# EAGLE design Lumiboard - sensor module (rev C) (EAGLE 6.5.0)
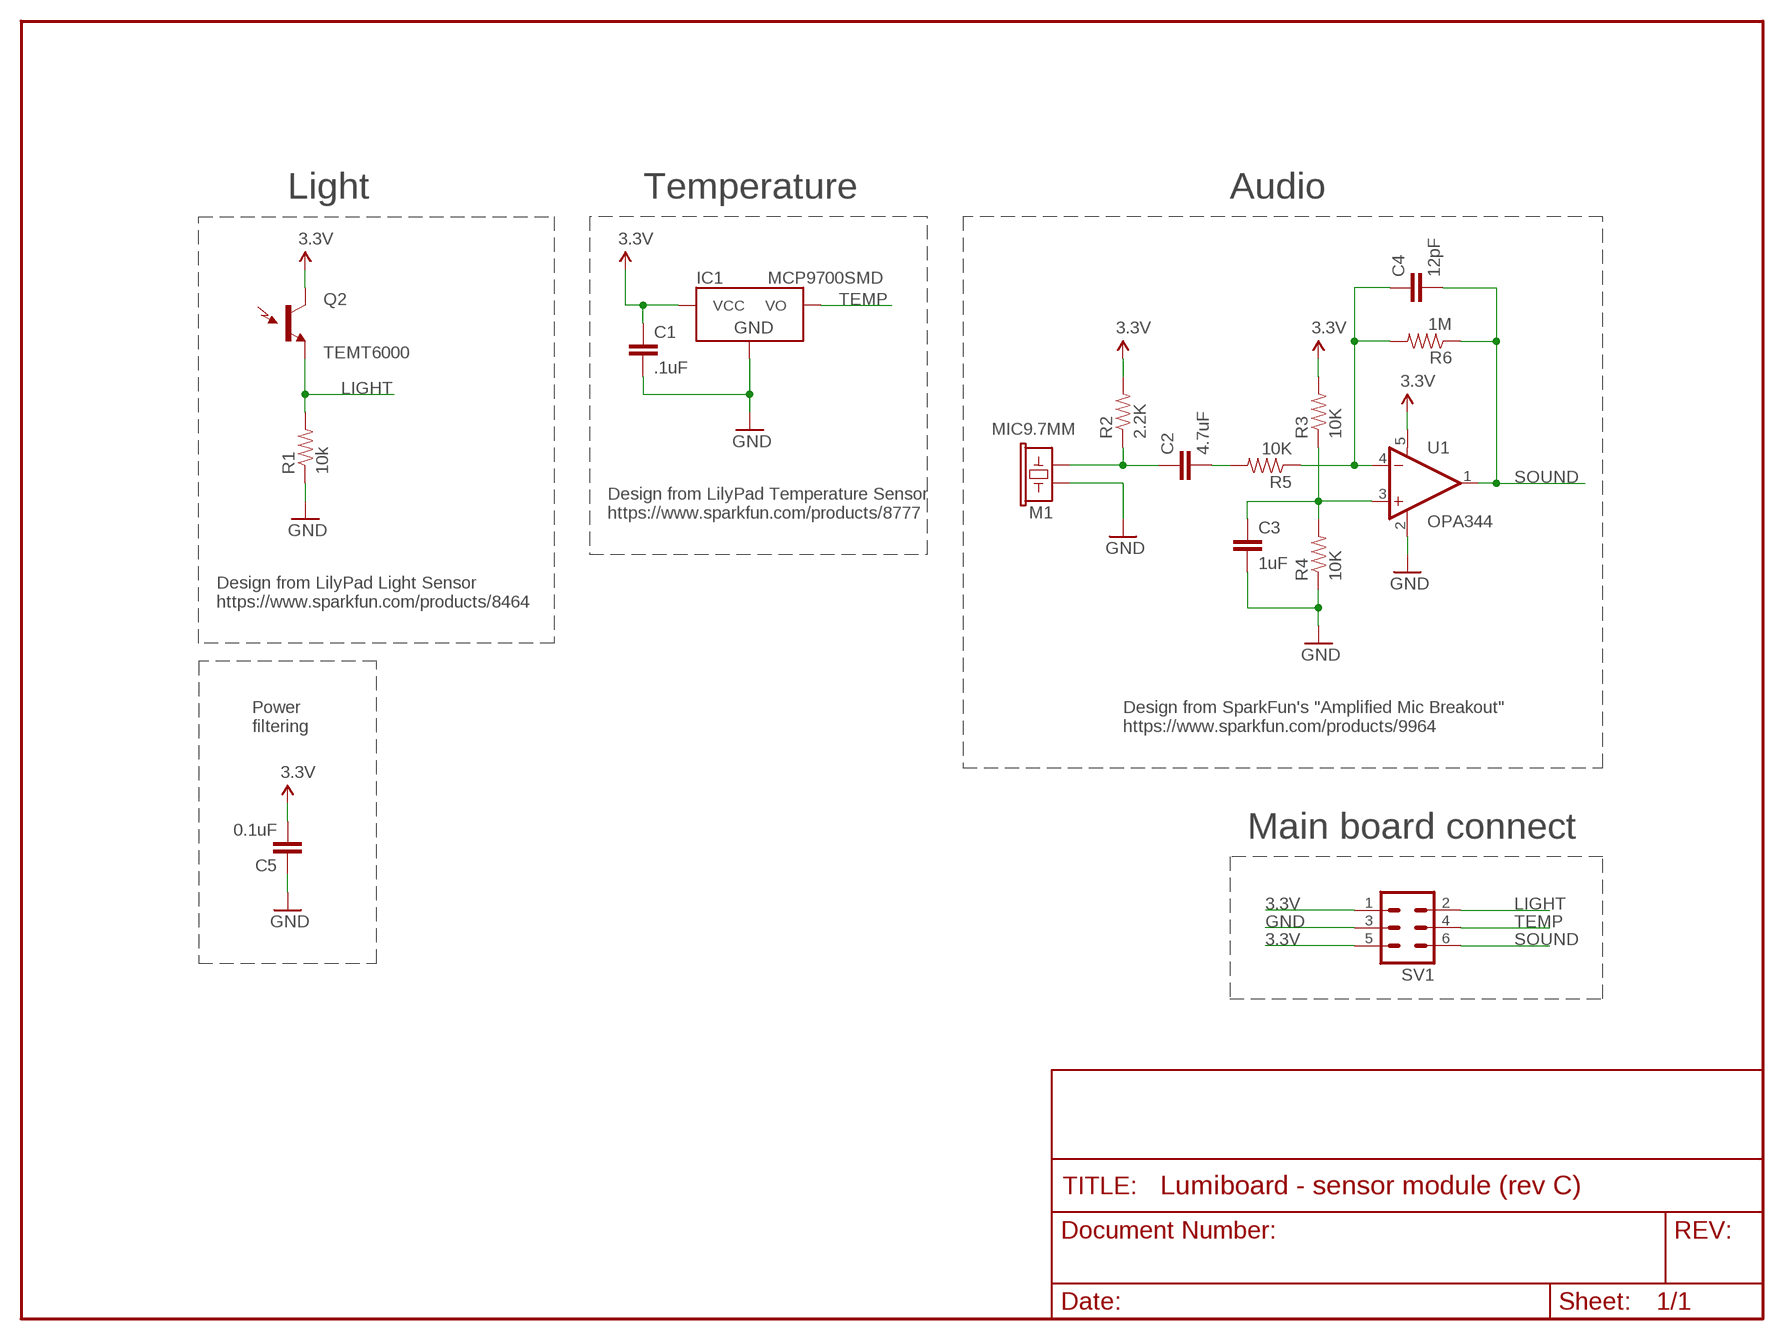
[diagram p0: schematic, sheet 1]

## Parts
C1  .1uF  CAP0805  [0805]
C2  4.7uF  CAP0805  [0805]
C3  1uF  CAP0805  [0805]
C4  12pF  CAP0805  [0805]
C5  0.1uF  CAP0805  [0805]
IC1  MCP9700SMD  [SOT23-3]
M1  MIC9.7MM  [MIC-9.7MM]
Q2  TEMT6000  [TEMT6000-SEN]
R1  10k  RESISTOR0805-RES  [0805]
R2  2.2K  RESISTOR0805-RES  [0805]
R3  10K  RESISTOR0805-RES  [0805]
R4  10K  RESISTOR0805-RES  [0805]
R5  10K  RESISTOR0805-RES  [0805]
R6  1M  RESISTOR0805-RES  [0805]
SV1  ML6  [ML6]
U1  OPA344  [SOT23-5]

## Nets
3.3V: C1.1 C5.2 IC1.1(VCC) Q2.COLLECTOR(C1) R2.2 R3.2 SV1.1 SV1.5 U1.5(V+)
GND: C1.2 C3.2 C5.1 IC1.3(GND) M1.2 R1.1 R4.1 SV1.3 U1.2(V-)
LIGHT: Q2.EMITTER(E1) R1.2 SV1.2
N$1: C2.1 M1.1 R2.1
N$2: C4.1 R5.1 R6.2 U1.4(-IN)
N$6: C2.2 R5.2
N$7: C3.1 R3.1 R4.2 U1.3(+IN)
SOUND: C4.2 R6.1 SV1.6 U1.1(OUT)
TEMP: IC1.2(VO) SV1.4

## Notes on the sheet
- Light | Temperature | Audio
- Design from LilyPad Temperature Sensor
  https://www.sparkfun.com/products/8777
- Design from LilyPad Light Sensor
  https://www.sparkfun.com/products/8464
- Power
  filtering
- Design from SparkFun's "Amplified Mic Breakout"
  https://www.sparkfun.com/products/9964
- Main board connect

## Library data of the parts
C1 = SparkFun:CAP: Capacitor Standard 0603 ceramic capacitor, and 0.1" leaded capacitor.
C2-C5 = SparkFun-Capacitors:CAP: Capacitor Standard 0603 ceramic capacitor, and 0.1" leaded capacitor.
IC1 = SparkFun:MCP9700
M1 = SparkFun:MIC: Microphone Omni-directional electret microphone. 9.7mm standard diameter.
Q2 = SparkFun:TEMT6000: Ambient Light Sensor Simple light detection sensor. Output varies with light intensity input. Spark Fun Electronics SKU : COM-08348
R1-R6 = SparkFun-Resistors:RESISTOR: Resistor Basic schematic elements and footprints for 0603, 1206, and PTH resistors.
SV1 = con-harting-ml:ML6: HARTING; OC_FARNELL: unknown; OC_NEWARK: unknown
U1 = SparkFun:OPA344

## Board
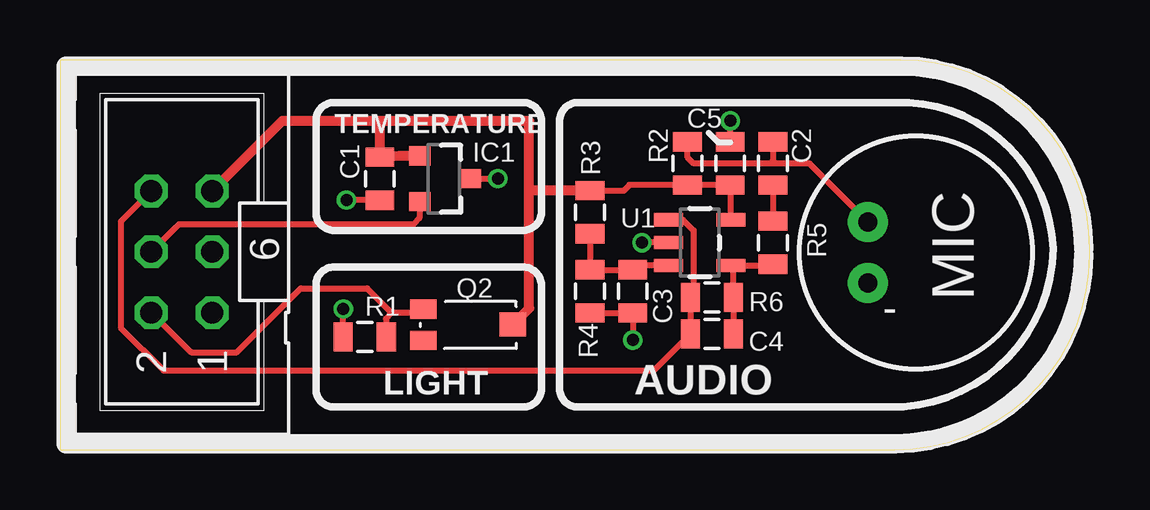
[diagram p1: board, top side]
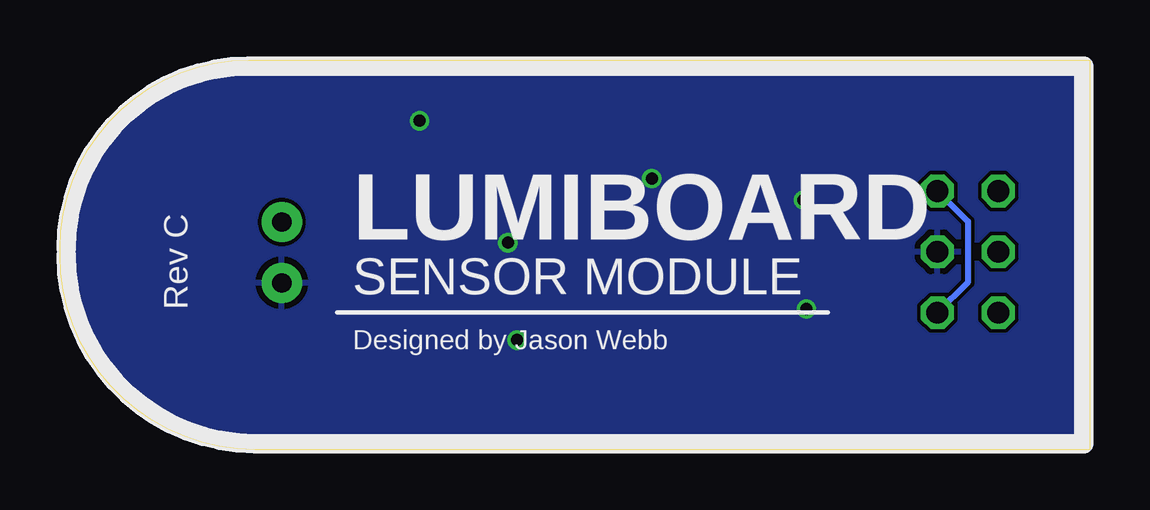
[diagram p2: board, bottom side, seen from below]

Size 42.93 x 16.26 mm. Coordinates in mm from the lower left corner, seen from the top.
Outline: 0,0 34.8,0 arc90 42.93,8.13 42.93,8.38 arc90 35.05,16.26 0,16.26 0,0
Copper layers (1*2*15*16): Top 0.035mm / dielectric 0.2mm / layer 2 0.0175mm / dielectric 1.1mm / layer 15 0.0175mm / dielectric 0.2mm / Bottom 0.035mm
Design rules "default": minimum track width 6mil, minimum drill 12mil, track to track 6mil, track to pad 6mil, pad to pad 6mil, via to via 6mil, smd to smd 0mil, copper to edge 10mil, drill to drill 10mil, minimum pad ring 6mil, minimum via ring 6mil, stop-mask expansion 2mil, vias tented up to drill 25mil, thermal gap 10mil

### Footprints (pad centres in the part's own frame; a part is rotated, then mirrored left to right if it is on the bottom)
0805 = smd 0.8 x 1.2: 1 -0.9,0; 2 0.9,0
SOT23-3 = smd 0.8 x 0.9: 1 -0.95,-1; 2 0.95,-1; 3 0,1.1
MIC-9.7MM = drill 0.8 pad 1.676: 1 -2,1.27; 2 -2,-1.27
TEMT6000-SEN = smd 1.1 x 0.8: BASE -1.87,-0.65; EMITTER -1.87,0.65 | smd 1.1 x 1: COLLECTOR 1.86,0.01
ML6 = drill 0.914 octagon: 1 -2.54,-1.27; 2 -2.54,1.27; 3 0,-1.27; 4 0,1.27; 5 2.54,-1.27; 6 2.54,1.27
SOT23-5 = smd 0.55 x 1.2: 1 -0.95,-1.3; 2 0,-1.3; 3 0.95,-1.3; 4 0.95,1.3; 5 -0.95,1.3

### Placement (x,y rotation side)
C1  13.34,11.3 270 top
C2  29.72,11.94 270 top
C3  23.88,6.6 270 top
C4  27.18,4.83 180 top
C5  27.94,11.94 270 top
IC1  16,11.3 270 top
M1  35.68,8.23 0 top
Q2  17.02,5.21 0 top
R1  12.7,4.7 0 top
R2  26.16,11.94 270 top
R3  22.1,9.91 90 top
R4  22.1,6.6 90 top
R5  29.72,8.64 90 top
R6  27.18,6.35 0 top
SV1  5.08,8.26 90 top
U1  26.67,8.64 270 top

### Tracks (layer width: path | path; a pad name or v marks a point on that pad's centre or on a via)
3.3V
  Top 0.254: U1.5 27.97,11.01 C5.2 R2.2 23.74,11.04 23.5,10.79 22.11,10.79 R3.2
  Top 0.406: SV1.5 9.27,13.72 13.34,13.72 | 13.34,13.72 19.56,13.72 19.56,10.81 | IC1.1 14.15,12.25 C1.1 13.34,13.72 | Q2.COLLECTOR 19.56,5.9 19.56,10.81 | R3.2 19.56,10.81
  Bottom 0.254: SV1.5 5.08,9.53 5.08,6.99 SV1.1
GND  (via drill 0.5, 0.5 pad 0.38)
  Top 0.254: IC1.3 v18.25,11.31 | C1.2 v11.95,10.4 v11.94,10.41 | R1.1 v11.81,5.87 | C5.1 v27.94,13.72 | v23.88,4.57 C3.2 R4.1 | U1.2 v24.26,8.64
  pour Bottom: -0.25,-0.25 33.53,-0.25 arc90 43.18,7.37 43.18,8.38 arc90 34.8,16.76 -0.25,16.51
LIGHT
  Top 0.254: SV1.2 5.46,4.06 7.37,4.06 10.03,6.73 12.8,6.73 13.83,5.7 | Q2.EMITTER 14.99,5.7 13.83,5.7 | 13.83,5.7 13.59,5.46 R1.2
N$1
  Top 0.254: M1.1 31.24,11.94 29.84,11.94 | 29.84,11.94 26.42,11.94 26.16,12.19 R2.1 | C2.1 29.72,12.06 29.84,11.94
N$2
  Top 0.254: C4.1 R6.2 28.08,7.58 U1.4 29.67,7.69 R5.1
N$6
  Top 0.254: C2.2 R5.2
N$7
  Top 0.254: R3.1 R4.2 C3.1 24.06,7.69 U1.3
SOUND
  Top 0.254: SV1.6 2.54,9.53 2.54,5.08 4.32,3.3 24.75,3.3 C4.2 R6.1 26.42,6.49 26.42,9.14 25.97,9.59 U1.1
TEMP
  Top 0.254: IC1.2 14.99,10.34 14.99,9.65 14.73,9.4 4.95,9.4 SV1.4

### Text on the board
tPlace: TEMPERATURE | AUDIO | LIGHT
bPlace: LUMIBOARD | SENSOR MODULE | Rev C | Designed by Jason Webb
tNames: MIC
tDocu: Size (in): 1.64x0.69" / Size (cm): 4.1656x1.651cm / SMT part pads: 22 / SMT IC pads: 11 / PTH holes: 8